# EAGLE design new (EAGLE 9.6.2)
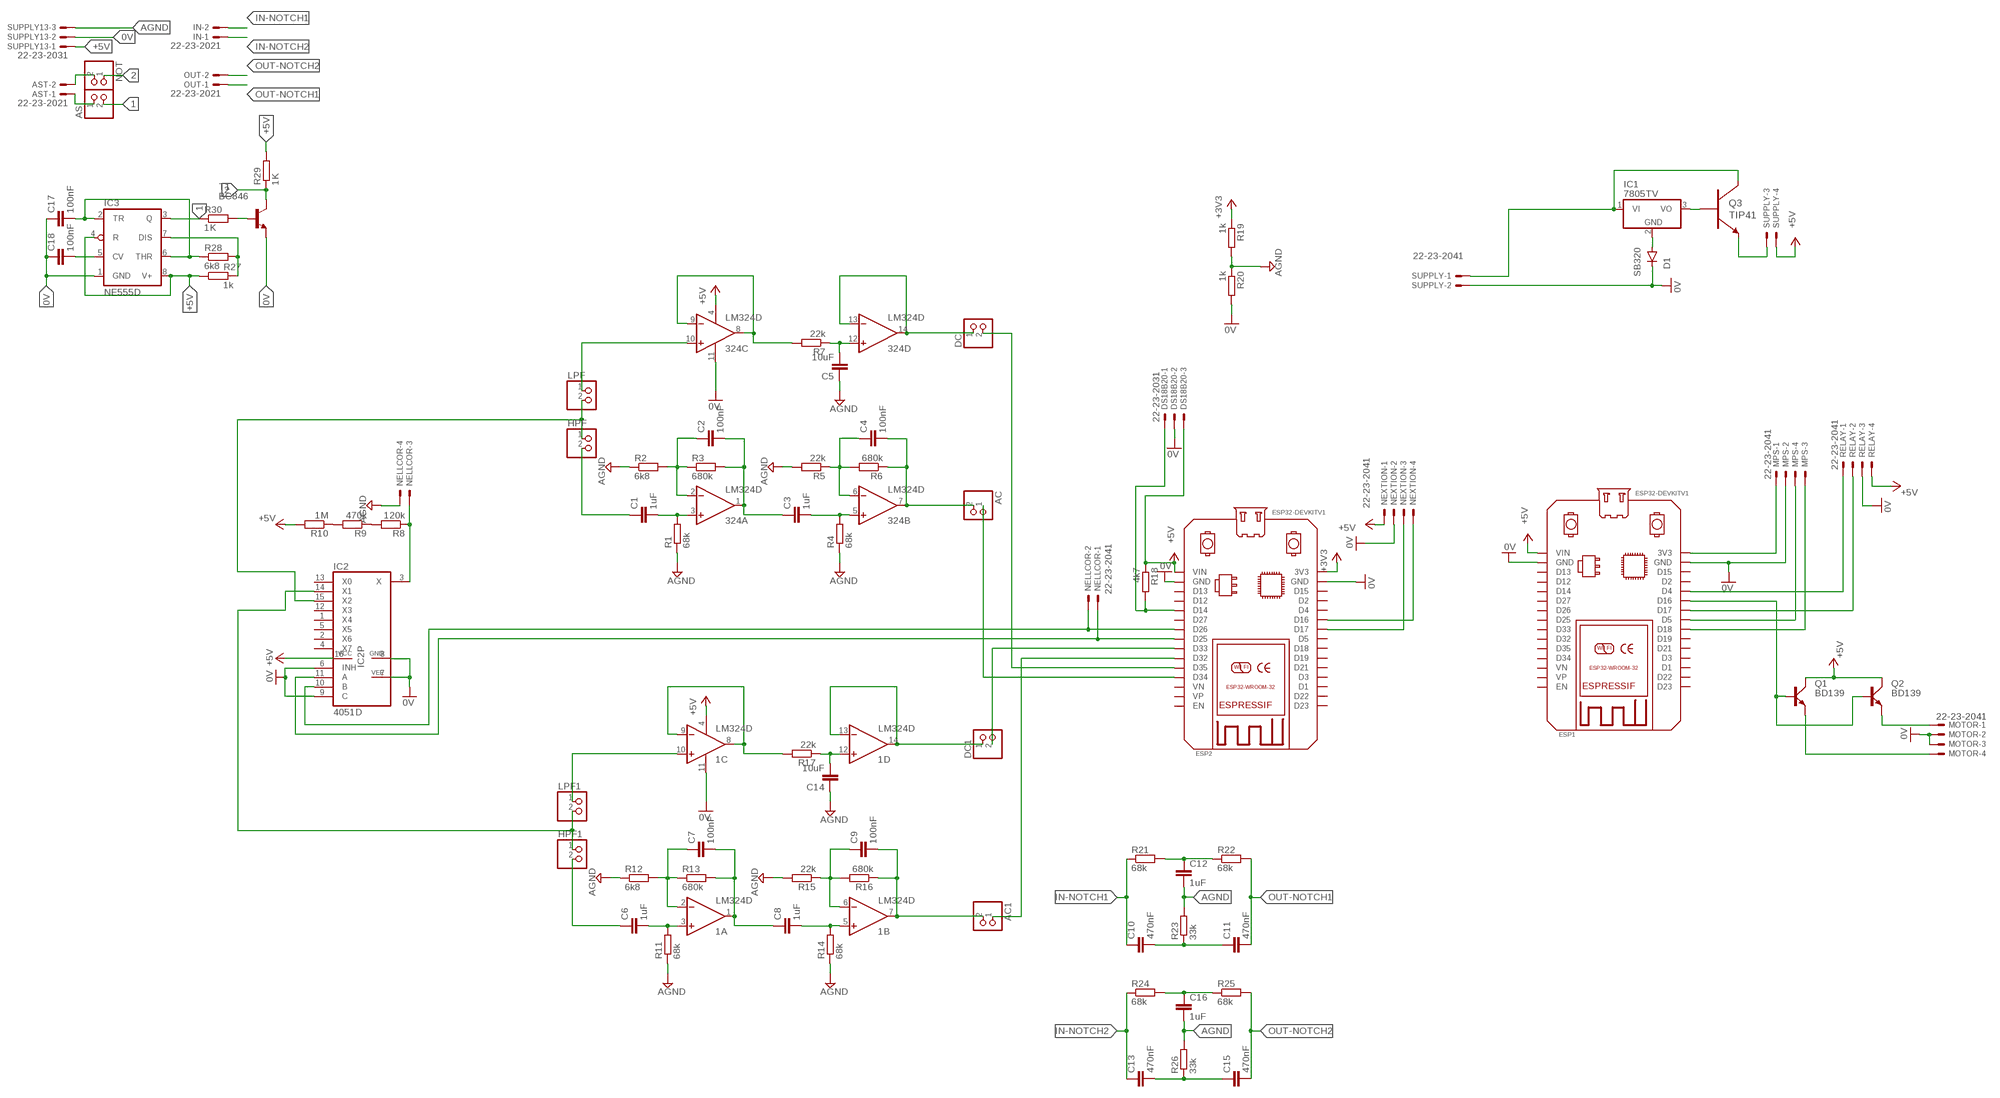
[diagram p0: schematic, sheet 1]

## Parts
1  LM324D  [SO14]
324  LM324D  [SO14]
AC  PINHD-1X2  [1X02]
AC1  PINHD-1X2  [1X02]
AS  PINHD-1X2  [1X02]
AST  22-23-2021  [22-23-2021]
C1  1uF  C-EUC0603  [C0603]
C2  100nF  C-EUC0603  [C0603]
C3  1uF  C-EUC0603  [C0603]
C4  100nF  C-EUC0603  [C0603]
C5  10uF  C-EUC0603  [C0603]
C6  1uF  C-EUC0603  [C0603]
C7  100nF  C-EUC0603  [C0603]
C8  1uF  C-EUC0603  [C0603]
C9  100nF  C-EUC0603  [C0603]
C10  470nF  C-EUC0603  [C0603]
C11  470nF  C-EUC0603  [C0603]
C12  1uF  C-EUC0603  [C0603]
C13  470nF  C-EUC0603  [C0603]
C14  10uF  C-EUC0603  [C0603]
C15  470nF  C-EUC0603  [C0603]
C16  1uF  C-EUC0603  [C0603]
C17  100nF  C-EUC0603  [C0603]
C18  100nF  C-EUC0603  [C0603]
D1  SB320  [DO201-15]
DC  PINHD-1X2  [1X02]
DC1  PINHD-1X2  [1X02]
DS18B20  22-23-2031  [22-23-2031]
ESP1  ESP32DEVKITV1  [ESP32-DEVKITV1]
ESP2  ESP32DEVKITV1  [ESP32-DEVKITV1]
HPF  PINHD-1X2  [1X02]
HPF1  PINHD-1X2  [1X02]
IC1  7805TV  [TO220V]
IC2  4051D  [SO16]
IC3  NE555D  [SO08]
IN  22-23-2021  [22-23-2021]
LPF  PINHD-1X2  [1X02]
LPF1  PINHD-1X2  [1X02]
MOTOR  22-23-2041  [22-23-2041]
MPS  22-23-2041  [22-23-2041]
NELLCOR  22-23-2041  [22-23-2041]
NEXTION  22-23-2041  [22-23-2041]
NOT  PINHD-1X2  [1X02]
OUT  22-23-2021  [22-23-2021]
Q1  BD139  [TO126AV]
Q2  BD139  [TO126AV]
Q3  TIP41  [TO-220AB]
R1  68k  R-EU_R0603  [R0603]
R2  6k8  R-EU_R0603  [R0603]
R3  680k  R-EU_R0603  [R0603]
R4  68k  R-EU_R0603  [R0603]
R5  22k  R-EU_R0603  [R0603]
R6  680k  R-EU_R0603  [R0603]
R7  22k  R-EU_R0603  [R0603]
R8  120k  R-EU_R0603  [R0603]
R9  470k  R-EU_R0603  [R0603]
R10  1M  R-EU_R0603  [R0603]
R11  68k  R-EU_R0603  [R0603]
R12  6k8  R-EU_R0603  [R0603]
R13  680k  R-EU_R0603  [R0603]
R14  68k  R-EU_R0603  [R0603]
R15  22k  R-EU_R0603  [R0603]
R16  680k  R-EU_R0603  [R0603]
R17  22k  R-EU_R0603  [R0603]
R18  4k7  R-EU_R0603  [R0603]
R19  1k  R-EU_R0603  [R0603]
R20  1k  R-EU_R0603  [R0603]
R21  68k  R-EU_R0603  [R0603]
R22  68k  R-EU_R0603  [R0603]
R23  33k  R-EU_R0603  [R0603]
R24  68k  R-EU_R0603  [R0603]
R25  68k  R-EU_R0603  [R0603]
R26  33k  R-EU_R0603  [R0603]
R27  1k  R-EU_R0603  [R0603]
R28  6k8  R-EU_R0603  [R0603]
R29  1K  R-EU_R0603  [R0603]
R30  1K  R-EU_R0603  [R0603]
RELAY  22-23-2041  [22-23-2041]
SUPPLY  22-23-2041  [22-23-2041]
SUPPLY13  22-23-2031  [22-23-2031]
T1  BC846  [SOT23]

## Nets
0V: 1.11(P:V-) 324.11(P:V-) C17.1 C18.1 D1.C DS18B20.2 ESP1.GND ESP1.GND@1(GND) ESP2.GND ESP2.GND@1(GND) IC2.6(INH) IC2.7(VEE) IC2.8(GND) IC2.9(C) IC3.1(GND) MOTOR.2 MOTOR.3 MPS.2 NEXTION.2 R20.2 RELAY.3 SUPPLY13.2 SUPPLY.2 T1.2(E)
1: AS.2 IC3.3(Q) R30.1
2: NOT.1 R29.1 T1.3(C)
+3V3: ESP2.3V3 R19.1
+5V: 1.4(P:V+) 324.4(P:V+) DS18B20.3 ESP1.VIN ESP2.VIN IC2.16(VCC) IC3.4(R) IC3.8(V+) NEXTION.1 Q1.C Q2.C R10.2 R18.1 R27.1 R29.2 RELAY.4 SUPPLY13.1 SUPPLY.4
AGND: C5.1 C12.2 C14.1 C16.2 NELLCOR.4 R1.1 R2.1 R4.1 R5.2 R11.1 R12.1 R14.1 R15.2 R19.2 R20.1 R23.2 R26.2 SUPPLY13.3
IN-NOTCH1: C10.1 IN.2 R21.1
IN-NOTCH2: C13.1 IN.1 R24.1
N$1: 324.3(A:+IN) C1.2 R1.2
N$2: 324.5(B:+IN) C3.2 R4.2
N$3: 324.6(B:-IN) C4.1 R5.1 R6.2
N$4: 324.7(B:OUT) AC.2 C4.2 R6.1
N$5: 324.1(A:OUT) C2.2 C3.1 R3.2
N$6: 324.2(A:-IN) C2.1 R2.2 R3.1
N$7: 324.8(C:OUT) 324.9(C:-IN) R7.2
N$8: 324.12(D:+IN) C5.2 R7.1
N$9: 324.13(D:-IN) 324.14(D:OUT) DC.1
N$10: 324.10(C:+IN) LPF.1
N$11: ESP2.D26 IC2.10(B) NELLCOR.2
N$12: IC2.3(X) NELLCOR.3 R8.1
N$13: R8.2 R9.1
N$14: C1.1 HPF.2
N$15: 1.3(A:+IN) C6.2 R11.2
N$16: 1.6(B:-IN) C9.1 R15.1 R16.2
N$17: DC1.2 ESP2.D33
N$18: R9.2 R10.1
N$19: ESP1.3V3 MPS.1
N$20: 1.7(B:OUT) AC1.2 C9.2 R16.1
N$21: 1.1(A:OUT) C7.2 C8.1 R13.2
N$22: ESP2.D16 NEXTION.4
N$23: 1.2(A:-IN) C7.1 R12.2 R13.1
N$24: HPF.1 IC2.15(X2) LPF.2
N$25: 1.8(C:OUT) 1.9(C:-IN) R17.2
N$26: 1.5(B:+IN) C8.2 R14.2
N$27: HPF1.1 IC2.14(X1) LPF1.2
N$28: ESP1.D17 RELAY.2
N$29: ESP1.D5 MPS.4
N$30: ESP1.D18 MPS.3
N$31: ESP1.D4 RELAY.1
N$32: ESP2.D25 IC2.11(A) NELLCOR.1
N$33: 1.12(D:+IN) C14.2 R17.1
N$34: 1.13(D:-IN) 1.14(D:OUT) DC1.1
N$35: ESP1.D16 Q1.B Q2.B
N$36: DC.2 ESP2.D35
N$37: AC1.1 ESP2.D32
N$38: 1.10(C:+IN) LPF1.1
N$39: C6.1 HPF1.2
N$40: AC.1 ESP2.D34
N$41: DS18B20.1 ESP2.D14 R18.2
N$42: ESP2.D17 NEXTION.3
N$43: MOTOR.1 Q2.E
N$44: MOTOR.4 Q1.E
N$45: IC1.1(VI) Q3.2(C) SUPPLY.1
N$46: IC1.3(VO) Q3.1(B)
N$47: Q3.3(E) SUPPLY.3
N$50: D1.A IC1.2(GND)
N$51: C12.1 R21.2 R22.1
N$52: C10.2 C11.1 R23.1
N$53: C16.1 R24.2 R25.1
N$54: C13.2 C15.1 R26.1
N$55: C17.2 IC3.2(TR) IC3.6(THR) R28.1
N$56: IC3.7(DIS) R27.2 R28.2
N$57: C18.2 IC3.5(CV)
N$58: R30.2 T1.1(B)
N$59: AST.2 NOT.2
N$60: AS.1 AST.1
OUT-NOTCH1: C11.2 OUT.1 R22.2
OUT-NOTCH2: C15.2 OUT.2 R25.2
Unconnected: ESP1.D1 ESP1.D2 ESP1.D3 ESP1.D12 ESP1.D13 ESP1.D14 ESP1.D15 ESP1.D19 ESP1.D21 ESP1.D22 ESP1.D23 ESP1.D25 ESP1.D26 ESP1.D27 ESP1.D32 ESP1.D33 ESP1.D34 ESP1.D35 ESP1.EN ESP1.VN ESP1.VP ESP2.D1 ESP2.D2 ESP2.D3 ESP2.D4 ESP2.D5 ESP2.D12 ESP2.D13 ESP2.D15 ESP2.D18 ESP2.D19 ESP2.D21 ESP2.D22 ESP2.D23 ESP2.D27 ESP2.EN ESP2.VN ESP2.VP IC2.1(X4) IC2.2(X6) IC2.4(X7) IC2.5(X5) IC2.12(X3) IC2.13(X0)

## Library data of the parts
1 324 = linear:LM324: OP AMP
AC AC1 AS DC DC1 HPF HPF1 LPF LPF1 NOT = pinhead:PINHD-1X2: PIN HEADER
AST IN OUT = con-molex:22-23-2021: .100" (2.54mm) Center Header - 2 Pin; MF: MOLEX; MPN: 22-23-2021; OC_FARNELL: 1462926; OC_NEWARK: 25C3832
C1-C18 = rcl:C-EU: CAPACITOR, European symbol; SPICEPREFIX: C
D1 = diode:SB320: DIODE barrier rectifier, 3 A (Fairchild)
DS18B20 SUPPLY13 = con-molex:22-23-2031: .100" (2.54mm) Center Header - 3 Pin; MF: MOLEX; MPN: 22-23-2031; OC_FARNELL: 1462950; OC_NEWARK: 30C0862
ESP1 ESP2 = ESP32-DEVKITV1:ESP32DEVKITV1: https://github.com/shridattdudhat
IC1 = linear:78*: Positive VOLTAGE REGULATOR Source: http://cache.national.com/ds/LM/LM78L05.pdf http://www.fairchildsemi.com/ds/LM/LM7805.pdf
IC2 = 40xx:4051: 8-channel ANALOG MULTIPLEXER
IC3 = linear:*555: TIMER
MOTOR MPS NELLCOR NEXTION RELAY SUPPLY = con-molex:22-23-2041: .100" (2.54mm) Center Header - 4 Pin; MF: MOLEX; MPN: 22-23-2041; OC_FARNELL: 1462920; OC_NEWARK: 38C0355
Q1 Q2 = transistor-power:BD139: NPN TRANSISTOR
Q3 = TIP41:TIP41: NPN, 6A 60V, power Check availability <https://pricing.snapeda.com/parts/TIP41/ON%20Semiconductor/view-part?ref=eda>; AVAILABILITY: In Stock; CHECK_PRICES: https://www.snapeda.com/parts/TIP41/Onsemi/view-part/?ref=eda; DESCRIPTION: Bipolar (BJT) Transistor NPN 40 V 6 A 3MHz 2 W Through Hole TO-220-3; MF: ON Semiconductor; MP: TIP41; PACKAGE: TO-220-3 ON; PRICE: None; SNAPEDA_LINK: https://www.snapeda.com/parts/TIP41/Onsemi/view-part/?ref=snap
R1-R30 = rcl:R-EU_: RESISTOR, European symbol; SPICEPREFIX: R
T1 = transistor:BC846: NPN TRANSISTOR

## Board
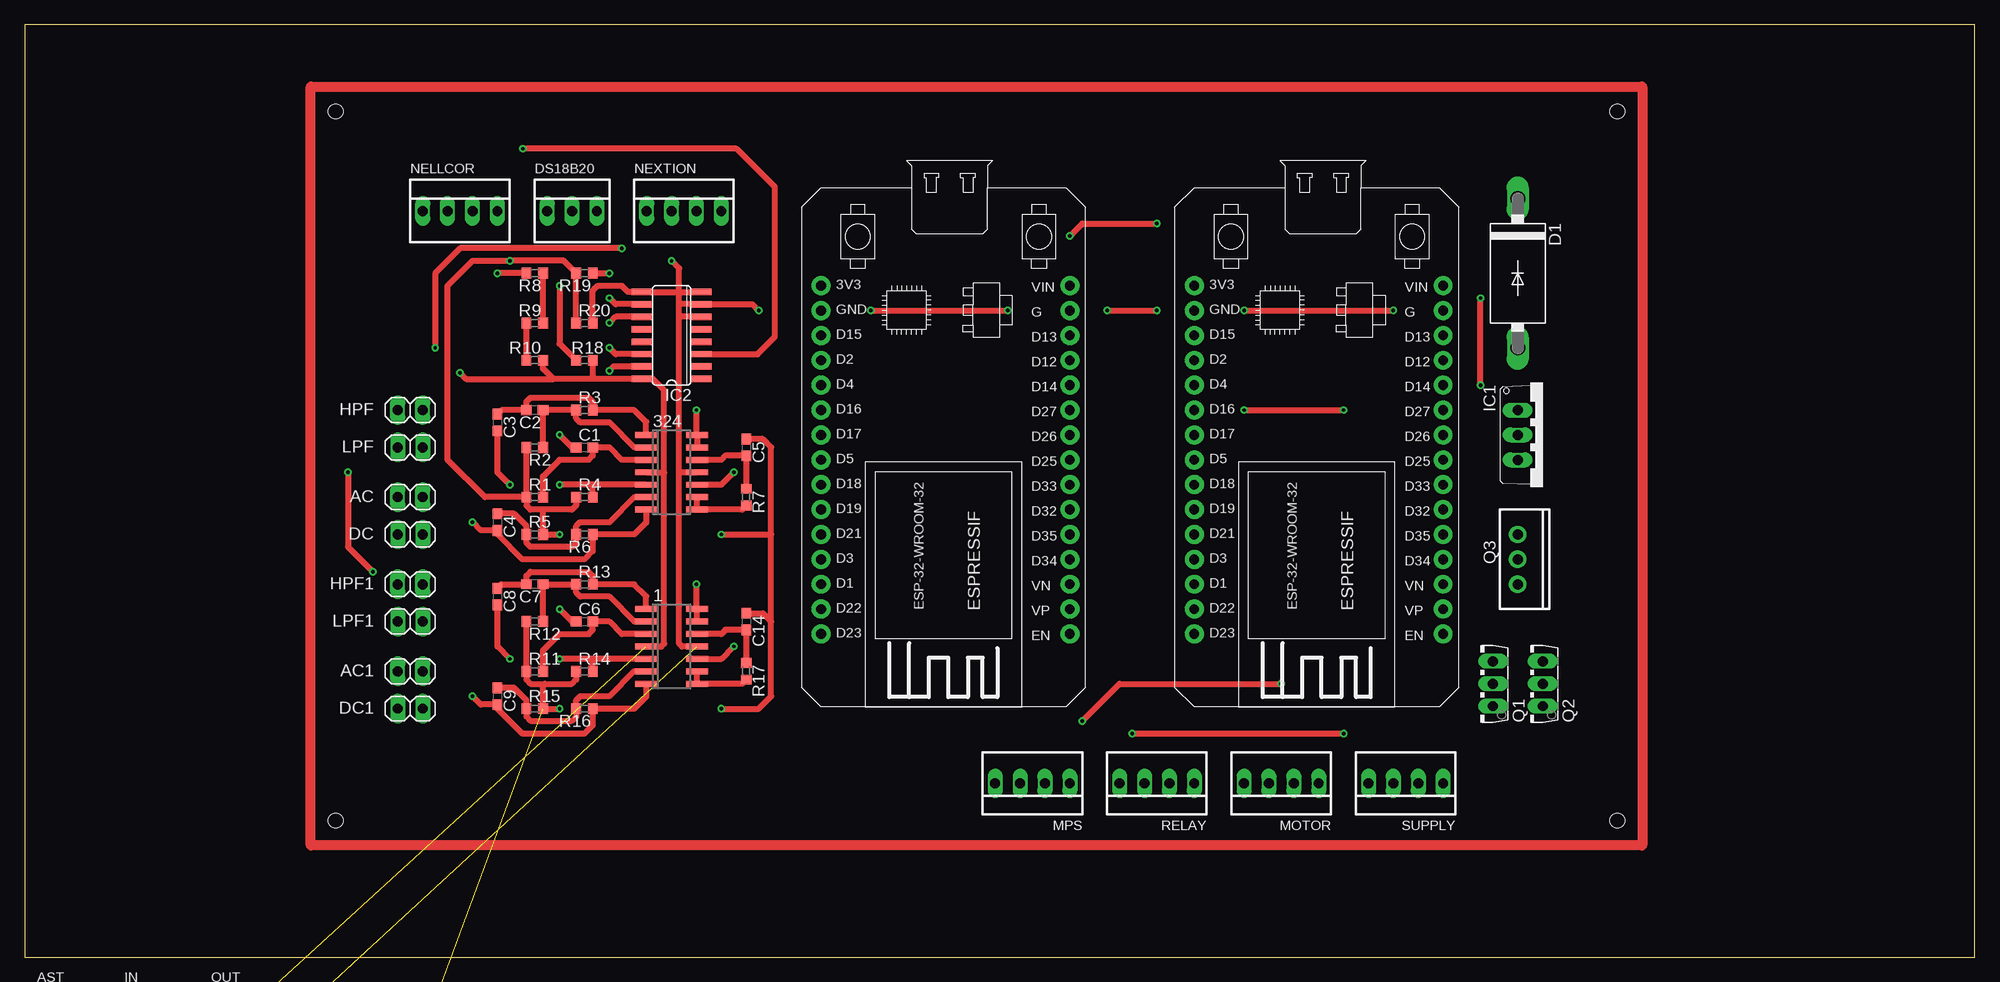
[diagram p1: board, top side]
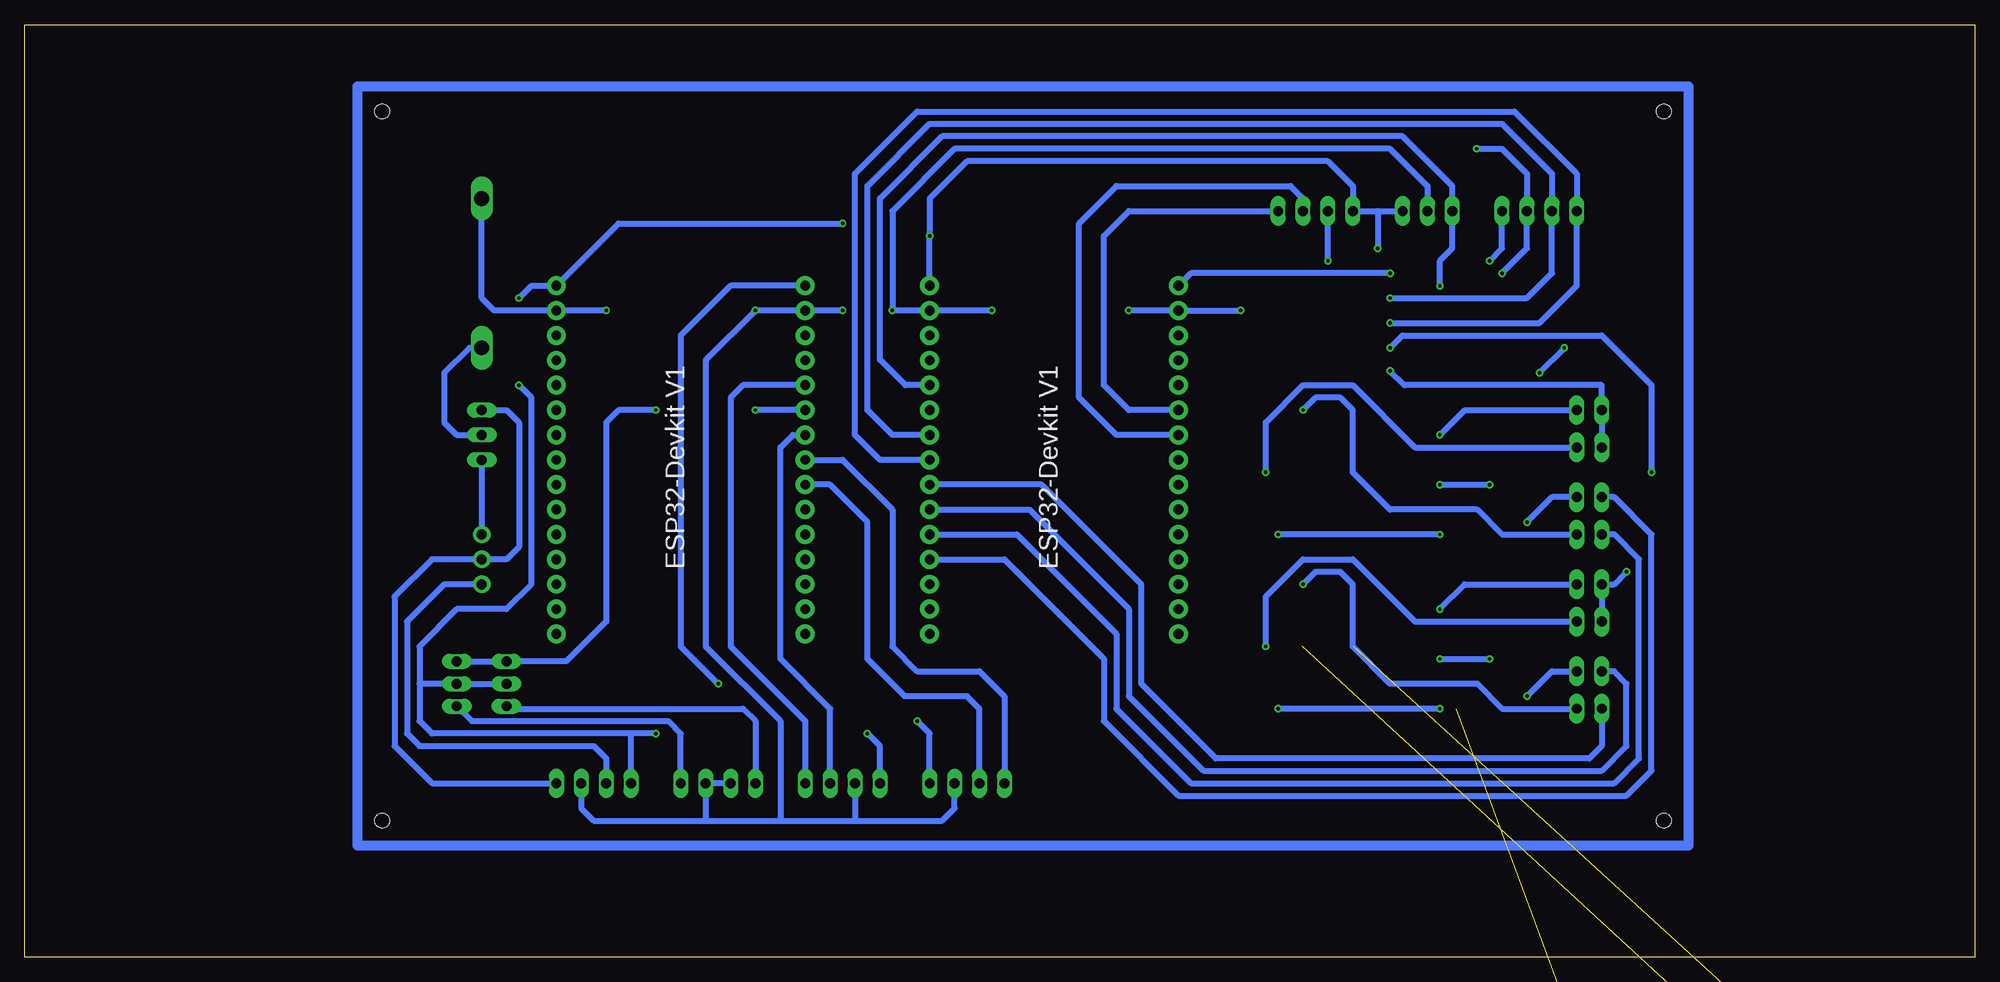
[diagram p2: board, bottom side, seen from below]

Size 199.06 x 95.24 mm. Coordinates in mm from the lower left corner, seen from the top.
Outline: 0,0 199.06,0 199.06,95.24 0,95.24 0,0
Copper layers (1*16): Top 0.035mm / dielectric 1.5mm / Bottom 0.035mm
Design rules "default": minimum track width 6mil, minimum drill 0.35mm, track to track 6mil, track to pad 6mil, pad to pad 6mil, via to via 6mil, smd to smd 6mil, copper to edge 40mil, drill to drill 6mil, minimum pad ring 10mil, minimum via ring 8mil, stop-mask expansion 4mil, vias tented up to drill 0mil, thermal gap 10mil
Holes 1.5 mm at 31.75,86.36 162.56,86.36 162.56,13.97 31.75,13.97

### Footprints (pad centres in the part's own frame; a part is rotated, then mirrored left to right if it is on the bottom)
SO14 = smd 0.6 x 2.2: 1 -3.81,-2.6; 2 -2.54,-2.6; 3 -1.27,-2.6; 4 0,-2.6; 5 1.27,-2.6; 6 2.54,-2.6; 7 3.81,-2.6; 8 3.81,2.6; 9 2.54,2.6; 10 1.27,2.6; 11 0,2.6; 12 -1.27,2.6; 13 -2.54,2.6; 14 -3.81,2.6
1X02 = drill 1.016 long: 1 -1.27,0; 2 1.27,0
22-23-2021 = drill 1 long: 1 -1.27,0; 2 1.27,0
C0603 = smd 1.1 x 1: 1 -0.85,0; 2 0.85,0
DO201-15 = drill 1.499 long: A 7.62,0; C -7.62,0
22-23-2031 = drill 1 long: 1 -2.54,0; 2 0,0; 3 2.54,0
ESP32-DEVKITV1 = drill 1 pad 1.93: 3V3 0,0; D1 30.48,0; D2 7.62,0; D3 27.94,0; D4 10.16,0; D5 17.78,0; D12 7.62,25.4; D13 5.08,25.4; D14 10.16,25.4; D15 5.08,0; D16 12.7,0; D17 15.24,0; D18 20.32,0; D19 22.86,0; D21 25.4,0; D22 33.02,0; D23 35.56,0; D25 17.78,25.4; D26 15.24,25.4; D27 12.7,25.4; D32 22.86,25.4; D33 20.32,25.4; D34 27.94,25.4; D35 25.4,25.4; EN 35.56,25.4; GND 2.54,25.4; GND@1 2.54,0; VIN 0,25.4; VN 30.48,25.4; VP 33.02,25.4
TO220V = drill 1.016 long: 1 -2.54,-2.54; 2 0,-2.54; 3 2.54,-2.54
SO16 = smd 0.66 x 2.032: 1 -4.445,-3.073; 2 -3.175,-3.073; 3 -1.905,-3.073; 4 -0.635,-3.073; 5 0.635,-3.073; 6 1.905,-3.073; 7 3.175,-3.073; 8 4.445,-3.073; 9 4.445,3.073; 10 3.175,3.073; 11 1.905,3.073; 12 0.635,3.073; 13 -0.635,3.073; 14 -1.905,3.073; 15 -3.175,3.073; 16 -4.445,3.073
SO08 = smd 0.6 x 2.2: 1 -1.905,-2.6; 2 -0.635,-2.6; 3 0.635,-2.6; 4 1.905,-2.6; 5 1.905,2.6; 6 0.635,2.6; 7 -0.635,2.6; 8 -1.905,2.6
22-23-2041 = drill 1 long: 1 -3.81,0; 2 -1.27,0; 3 1.27,0; 4 3.81,0
TO126AV = drill 1.016 long: B 2.286,-1.27; C 0,-1.27; E -2.286,-1.27
TO-220AB = drill 1.016 pad 1.778: 1 -2.54,0; 2 0,0; 3 2.54,0
R0603 = smd 1 x 1.1: 1 -0.85,0; 2 0.85,0
SOT23 = smd 1 x 1.4: 1 -0.95,-1.1; 2 0.95,-1.1; 3 0,1.1

### Placement (x,y rotation side)
1  66.04,31.75 270 top
324  66.04,49.53 270 top
AC  39.37,46.99 0 top
AC1  39.37,29.21 0 top
AS  30.48,-16.51 0 top  (outside the outline)
AST  3.81,-6.35 0 top  (outside the outline)
C1  57.15,52.07 0 top
C2  52.07,55.88 180 top
C3  48.26,54.61 270 top
C4  48.26,44.45 270 top
C5  73.66,52.07 270 top
C6  57.15,34.29 0 top
C7  52.07,38.1 180 top
C8  48.26,36.83 270 top
C9  48.26,26.67 270 top
C10  8.89,-26.67 0 top  (outside the outline)
C11  16.51,-26.67 0 top  (outside the outline)
C12  25.4,-33.02 0 top  (outside the outline)
C13  24.13,-26.67 0 top  (outside the outline)
C14  73.66,34.29 270 top
C15  2.54,-33.02 0 top  (outside the outline)
C16  30.48,-33.02 0 top  (outside the outline)
C17  10.16,-33.02 0 top  (outside the outline)
C18  17.78,-33.02 0 top  (outside the outline)
D1  152.4,69.85 270 top
DC  39.37,43.18 180 top
DC1  39.37,25.4 180 top
DS18B20  55.88,76.2 0 top
ESP1  119.38,68.58 270 top
ESP2  81.28,68.58 270 top
HPF  39.37,55.88 0 top
HPF1  39.37,38.1 0 top
IC1  154.94,53.34 270 top
IC2  66.04,63.5 90 top
IC3  13.97,-17.78 0 top  (outside the outline)
IN  12.7,-6.35 0 top  (outside the outline)
LPF  39.37,52.07 180 top
LPF1  39.37,34.29 180 top
MOTOR  128.27,17.78 180 top
MPS  102.87,17.78 180 top
NELLCOR  44.45,76.2 0 top
NEXTION  67.31,76.2 0 top
NOT  3.81,-27.94 0 top  (outside the outline)
OUT  21.59,-6.35 0 top  (outside the outline)
Q1  148.59,27.94 90 top
Q2  153.67,27.94 90 top
Q3  152.4,40.64 270 top
R1  52.07,46.99 0 top
R2  52.07,52.07 0 top
R3  57.15,55.88 0 top
R4  57.15,46.99 0 top
R5  52.07,43.18 0 top
R6  57.15,43.18 180 top
R7  73.66,46.99 270 top
R8  52.07,69.85 0 top
R9  52.07,64.77 180 top
R10  52.07,60.96 0 top
R11  52.07,29.21 0 top
R12  52.07,34.29 0 top
R13  57.15,38.1 0 top
R14  57.15,29.21 0 top
R15  52.07,25.4 0 top
R16  57.15,25.4 180 top
R17  73.66,29.21 270 top
R18  57.15,60.96 180 top
R19  57.15,69.85 180 top
R20  57.15,64.77 0 top
R21  2.54,-38.1 0 top  (outside the outline)
R22  7.62,-38.1 0 top  (outside the outline)
R23  12.7,-38.1 0 top  (outside the outline)
R24  17.78,-38.1 0 top  (outside the outline)
R25  22.86,-38.1 0 top  (outside the outline)
R26  27.94,-38.1 0 top  (outside the outline)
R27  2.54,-43.18 0 top  (outside the outline)
R28  7.62,-43.18 0 top  (outside the outline)
R29  12.7,-43.18 0 top  (outside the outline)
R30  17.78,-43.18 0 top  (outside the outline)
RELAY  115.57,17.78 180 top
SUPPLY  140.97,17.78 180 top
SUPPLY13  5.08,-17.78 0 top  (outside the outline)
T1  2.54,-64.77 0 top  (outside the outline)

### Tracks (layer width: path | path; a pad name or v marks a point on that pad's centre or on a via)
0V  (via drill 0.35)  (5 unrouted)
  Top 0.6: 67.87,49.53 324.11 66.79,49.53 | 1.11 67.1,31.75 66.79,32.06 66.79,34.22 66.79,49.53 | 66.82,67.94 IC2.9 61.59,67.94 60.96,68.58 58.5,68.58 58,68.08 R20.2 | 66.82,67.94 IC2.8 | 66.79,49.53 66.79,65.4 | 66.79,65.4 66.79,66.6 | 66.79,66.6 66.79,67.92 66.82,67.94 | IC2.6 66.79,65.4 | v86.36,66.04 v100.33,66.04 | 66.82,67.94 66.82,70.34 v66.04,71.12 | v74.93,66.04 74.3,66.67 IC2.7 66.86,66.67 66.79,66.6 | v110.49,66.04 v115.57,66.04 | v124.46,66.04 v139.7,66.04
  Bottom 0.6: v86.36,66.04 ESP2.GND@1 v74.93,66.04 | v100.33,66.04 ESP2.GND v110.49,66.04 110.49,76.2 104.14,82.55 59.69,82.55 55.88,78.74 DS18B20.2 | v66.04,71.12 NEXTION.2 | v115.57,66.04 ESP1.GND@1 v124.46,66.04 129.54,60.96 129.54,31.75 121.92,24.13 121.92,13.97 | D1.C 152.4,67.31 151.13,66.04 ESP1.GND v139.7,66.04 | SUPPLY.2 142.24,15.24 140.97,13.97 129.54,13.97 | 129.54,13.97 121.92,13.97 | 121.92,13.97 114.3,13.97 | 114.3,13.97 105.41,13.97 104.14,15.24 MPS.2 | 129.54,13.97 MOTOR.2 MOTOR.3 | RELAY.3 114.3,13.97
1  (2 unrouted)
2  (2 unrouted)
+3V3  (via drill 0.35)
  Top 0.6: R19.1 v59.69,69.85
  Bottom 0.6: v59.69,69.85 80.01,69.85 ESP2.3V3
+5V  (via drill 0.35)  (5 unrouted)
  Top 0.6: 64.21,31.75 1.4 64.99,31.75 65.29,32.05 65.29,49.5 | 65.29,49.5 65.29,57.9 64.14,59.05 IC2.16 57.98,59.05 | 324.4 65.26,49.53 65.29,49.5 | R10.2 52.92,60.11 53.98,59.05 | 57.98,59.05 53.98,59.05 | R18.1 58,59.08 57.98,59.05 | v60.96,72.39 44.45,72.39 41.91,69.85 v41.91,62.23 | v44.45,59.69 45.09,59.05 53.98,59.05 | v106.68,73.66 107.95,74.93 v115.57,74.93 | v113.03,22.86 v134.62,22.86 | v148.59,58.42 v148.59,67.31
  Bottom 0.6: 60.96,76.2 NEXTION.1 63.5,78.74 66.04,81.28 102.87,81.28 106.68,77.47 v106.68,73.66 ESP2.VIN | 60.96,76.2 DS18B20.3 | 60.96,76.2 v60.96,72.39 | v41.91,62.23 v44.45,59.69 | 158.75,27.94 158.75,24.13 157.48,22.86 137.16,22.86 | Q1.C Q2.C 158.75,27.94 | RELAY.4 111.76,21.59 v113.03,22.86 | v134.62,22.86 137.16,22.86 | SUPPLY.4 137.16,22.86 | 158.75,27.94 158.75,31.75 154.94,35.56 149.86,35.56 147.32,38.1 147.32,57.15 v148.59,58.42 | v148.59,67.31 147.32,68.58 ESP1.VIN 138.43,74.93 v115.57,74.93
AGND  (via drill 0.35)  (5 unrouted)
  Top 0.6: R12.1 R11.1 51.22,28.36 51.64,27.94 53.1,27.94 | 53.1,27.94 55.88,27.94 56.3,28.36 R14.1 | R1.1 R2.1 | R1.1 51.22,46.14 51.64,45.72 52.83,45.72 | R4.1 56.3,46.14 55.88,45.72 52.83,45.72 | 52.83,45.72 52.92,45.63 R5.2 v54.61,43.18 | 53.1,27.94 52.92,27.76 R15.2 v54.61,25.4 | C5.1 75.35,52.92 76.2,52.07 76.2,43.18 | 76.2,34.29 76.2,43.18 | v71.12,43.18 76.2,43.18 | v71.12,25.4 74.93,25.4 76.2,26.67 76.2,34.29 | C14.1 75.35,35.14 76.2,34.29 | R1.1 46.99,46.99 43.18,50.8 43.18,68.58 45.72,71.12 v49.53,71.12 55.03,71.12 R19.2 R20.1
  Bottom 0.6: v54.61,43.18 v71.12,43.18 | v54.61,25.4 v71.12,25.4 | v49.53,71.12 48.26,72.39 NELLCOR.4
IN-NOTCH1  (2 unrouted)
IN-NOTCH2  (2 unrouted)
N$1
  Top 0.6: 324.3 60.96,50.8 59.69,52.07 C1.2 58,51.22 57.58,50.8 54.61,50.8 52.92,49.11 R1.2
N$2  (via drill 0.35)
  Top 0.6: v49.53,48.26 48.26,49.53 C3.2 | 324.5 58.03,48.26 | 58.03,48.26 v54.61,48.26 | R4.2 58,48.23 58.03,48.26
  Bottom 0.6: v54.61,48.26 v49.53,48.26
N$3
  Top 0.6: 324.6 62.23,46.99 59.69,44.45 56.72,44.45 56.3,44.03 R6.2 56.3,42.33 55.88,41.91 51.64,41.91 51.22,42.33 R5.1 51.22,44.03 49.95,45.3 C4.1
N$4  (via drill 0.35)
  Top 0.6: 324.7 63.44,44.39 62.23,43.18 R6.1 58,41.49 57.15,40.64 50.8,40.64 48.26,43.18 C4.2 46.57,43.6 v45.72,44.45
  Bottom 0.6: AC.2 43.18,46.99 v45.72,44.45
N$5
  Top 0.6: 324.1 63.44,54.67 62.23,55.88 R3.2 58,56.73 57.58,57.15 51.64,57.15 51.22,56.73 C2.2 48.68,55.88 C3.1
N$6
  Top 0.6: R2.2 C2.1 R3.1 56.3,55.03 56.72,54.61 59.69,54.61 62.23,52.07 324.2
N$7
  Top 0.6: 324.9 324.8 73.24,45.72 R7.2
N$8
  Top 0.6: R7.1 C5.2 71.54,51.22 71.12,50.8 324.12
N$9  (via drill 0.35)
  Top 0.6: 324.13 324.14 68.58,53.4 v68.58,55.88
  Bottom 0.6: v68.58,55.88 67.31,57.15 64.77,57.15 63.5,55.88 63.5,49.53 59.69,45.72 50.8,45.72 48.26,43.18 DC.1
N$10  (via drill 0.35)
  Top 0.6: 324.10 71.12,48.26 v72.39,49.53
  Bottom 0.6: v72.39,49.53 72.39,54.61 68.58,58.42 63.5,58.42 57.15,52.07 LPF.1
N$11  (via drill 0.35)
  Top 0.6: IC2.10 60.33,66.67 v59.69,67.31
  Bottom 0.6: v59.69,67.31 45.72,67.31 43.18,69.85 NELLCOR.2 43.18,80.01 48.26,85.09 106.68,85.09 113.03,78.74 113.03,55.88 110.49,53.34 ESP2.D26
N$12  (via drill 0.35)
  Top 0.6: R8.1 v48.26,69.85 | IC2.3 74.81,61.59 76.58,63.36 76.58,78.66 72.68,82.56 v50.88,82.56
  Bottom 0.6: v48.26,69.85 45.72,72.39 NELLCOR.3 45.72,80.01 48.27,82.56 v50.88,82.56
N$13
  Top 0.6: R9.1 R8.2
N$14  (via drill 0.35)
  Top 0.6: C1.1 55.88,52.07 v54.61,53.34
  Bottom 0.6: v54.61,53.34 52.07,55.88 HPF.2
N$15
  Top 0.6: 1.3 60.96,33.02 59.69,34.29 C6.2 58,33.44 57.58,33.02 54.61,33.02 52.92,31.33 R11.2
N$16
  Top 0.6: C9.1 49.95,27.52 51.22,26.25 R15.1 51.22,24.6 51.64,24.18 55.88,24.18 56.3,24.6 R16.2 56.3,26.25 56.72,26.67 59.69,26.67 62.23,29.21 1.6
N$17
  Bottom 0.6: DC1.2 38.1,21.59 39.37,20.32 77.47,20.32 85.09,27.94 85.09,38.1 95.25,48.26 ESP2.D33
N$18
  Top 0.6: R10.1 R9.2
N$19  (via drill 0.35)
  Top 0.6: v107.95,24.13 111.76,27.94 v128.27,27.94
  Bottom 0.6: ESP1.3V3 127,68.58 132.08,63.5 132.08,31.75 v128.27,27.94 | MPS.1 106.68,22.86 v107.95,24.13
N$20  (via drill 0.35)
  Top 0.6: 63.44,27.88 1.7 63.44,26.61 62.23,25.4 R16.1 58,23.71 57.15,22.86 50.8,22.86 48.26,25.4 C9.2 46.57,25.82 v45.72,26.67
  Bottom 0.6: v45.72,26.67 43.18,29.21 AC1.2
N$21
  Top 0.6: 63.44,35.62 1.1 63.44,36.89 62.23,38.1 R13.2 58,38.95 57.58,39.37 51.64,39.37 51.22,38.95 C7.2 48.68,38.1 C8.1
N$22
  Bottom 0.6: ESP2.D16 86.36,55.88 88.9,58.42 88.9,73.66 86.36,76.2 NEXTION.4
N$23
  Top 0.6: R12.2 C7.1 R13.1 56.3,37.25 56.72,36.83 59.69,36.83 62.23,34.29 1.2
N$24  (via drill 0.35)
  Top 0.6: IC2.15 60.13,60.33 v59.69,59.89
  Bottom 0.6: LPF.2 HPF.1 38.1,58.42 58.22,58.42 v59.69,59.89
N$25
  Top 0.6: 1.9 1.8 73.24,27.94 R17.2
N$26  (via drill 0.35)
  Top 0.6: 1.5 58,30.48 | 58,30.48 v54.61,30.48 | v49.53,30.48 48.26,31.75 C8.2 | R14.2 58,30.48
  Bottom 0.6: v54.61,30.48 v49.53,30.48
N$27  (via drill 0.35)
  Top 0.6: IC2.14 60.33,61.59 v59.69,62.23 | v35.56,39.37 33.02,41.91 v33.02,49.53
  Bottom 0.6: LPF1.2 HPF1.1 36.83,38.1 v35.56,39.37 | v59.69,62.23 58.42,63.5 38.1,63.5 33.02,58.42 v33.02,49.53
N$28
  Bottom 0.6: RELAY.2 116.84,25.4 121.92,30.48 121.92,52.07 120.65,53.34 ESP1.D17
N$29
  Bottom 0.6: ESP1.D5 115.57,50.8 110.49,45.72 110.49,31.75 107.95,29.21 101.6,29.21 99.06,26.67 MPS.4
N$30
  Bottom 0.6: MPS.3 101.6,25.4 102.87,26.67 109.22,26.67 113.03,30.48 113.03,44.45 116.84,48.26 ESP1.D18
N$31
  Bottom 0.6: RELAY.1 119.38,24.13 127,31.75 127,57.15 125.73,58.42 ESP1.D4
N$32  (via drill 0.35)
  Top 0.6: IC2.11 60.33,65.41 v59.69,64.77
  Bottom 0.6: v59.69,64.77 44.45,64.77 40.64,68.58 NELLCOR.1 40.64,80.01 46.99,86.36 107.95,86.36 114.3,80.01 114.3,53.34 111.76,50.8 ESP2.D25
N$33
  Top 0.6: R17.1 C14.2 71.54,33.44 71.12,33.02 1.12
N$34  (via drill 0.35)
  Top 0.6: 1.13 1.14 68.58,35.62 v68.58,38.1
  Bottom 0.6: v68.58,38.1 67.31,39.37 64.77,39.37 63.5,38.1 63.5,31.75 59.69,27.94 50.8,27.94 48.26,25.4 DC1.1
N$35  (via drill 0.35)
  Top 0.6: v124.46,55.88 v134.62,55.88
  Bottom 0.6: Q2.B Q1.B 143.76,30.23 139.7,34.29 139.7,54.61 138.43,55.88 v134.62,55.88 | ESP1.D16 v124.46,55.88
N$36
  Bottom 0.6: DC.2 36.83,43.18 34.29,40.64 34.29,20.32 36.83,17.78 80.01,17.78 87.63,25.4 87.63,33.02 97.79,43.18 ESP2.D35
N$37
  Bottom 0.6: AC1.1 36.83,29.21 35.56,27.94 35.56,21.59 38.1,19.05 78.74,19.05 86.36,26.67 86.36,35.56 96.52,45.72 ESP2.D32
N$38  (via drill 0.35)
  Top 0.6: 1.10 71.12,30.48 v72.39,31.75
  Bottom 0.6: v72.39,31.75 72.39,36.83 68.58,40.64 63.5,40.64 57.15,34.29 LPF1.1
N$39  (via drill 0.35)
  Top 0.6: C6.1 55.88,34.29 v54.61,35.56
  Bottom 0.6: v54.61,35.56 52.07,38.1 HPF1.2
N$40
  Bottom 0.6: ESP2.D34 99.06,40.64 88.9,30.48 88.9,24.13 81.28,16.51 35.56,16.51 33.02,19.05 33.02,43.18 36.83,46.99 AC.1
N$41  (via drill 0.35)
  Top 0.6: v54.61,68.58 54.61,62.65 R18.2
  Bottom 0.6: v54.61,68.58 54.61,71.12 53.34,72.39 DS18B20.1 53.34,78.74 58.42,83.82 105.41,83.82 111.76,77.47 111.76,61.03 109.15,58.42 ESP2.D14
N$42
  Bottom 0.6: ESP2.D17 87.63,53.34 91.44,57.15 91.44,74.93 87.63,78.74 69.85,78.74 68.58,77.47 NEXTION.3
N$43
  Bottom 0.6: MOTOR.1 132.08,22.86 133.35,24.13 153.42,24.13 Q2.E
N$44
  Bottom 0.6: Q1.E 149.61,25.4 125.73,25.4 124.46,24.13 MOTOR.4
N$45
  Bottom 0.6: IC1.1 149.86,55.88 148.59,54.61 148.59,41.91 149.86,40.64 Q3.2 157.48,40.64 161.29,36.83 161.29,21.59 157.48,17.78 SUPPLY.1
N$46
  Bottom 0.6: IC1.3 Q3.1
N$47
  Bottom 0.6: Q3.3 156.21,38.1 160.02,34.29 160.02,22.86 158.75,21.59 140.97,21.59 139.7,20.32 SUPPLY.3
N$48
  Top 1: 29.21,88.9 165.1,88.9 165.1,11.43 29.21,11.43 29.21,88.9
N$49
  Bottom 1: 29.21,88.9 165.1,88.9 165.1,11.43 29.21,11.43 29.21,88.9
N$50
  Bottom 0.6: D1.A 153.67,62.23 156.21,59.69 156.21,54.61 154.94,53.34 IC1.2
N$51  (2 unrouted)
N$52  (2 unrouted)
N$53  (2 unrouted)
N$54  (2 unrouted)
N$55  (3 unrouted)
N$56  (2 unrouted)
N$57  (1 unrouted)
N$58  (1 unrouted)
N$59  (1 unrouted)
N$60  (1 unrouted)
OUT-NOTCH1  (2 unrouted)
OUT-NOTCH2  (2 unrouted)